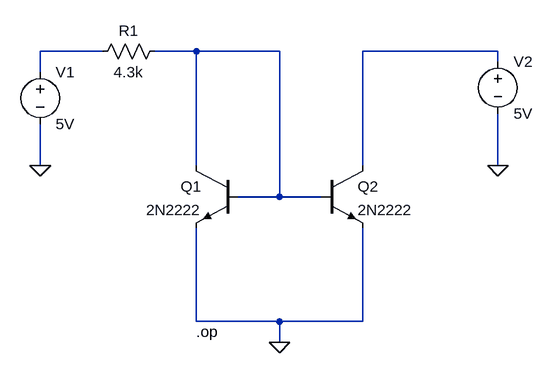
[diagram p0: schematic simple.asc]
simple.asc, the LTspice schematic file:
Version 4
SHEET 1 1128 680
WIRE 272 96 176 96
WIRE 416 96 352 96
WIRE 544 96 416 96
WIRE 880 96 672 96
WIRE 880 112 880 96
WIRE 176 128 176 96
WIRE 176 272 176 208
WIRE 416 272 416 96
WIRE 672 272 672 96
WIRE 880 272 880 192
WIRE 544 320 544 96
WIRE 544 320 480 320
WIRE 608 320 544 320
WIRE 416 512 416 368
WIRE 544 512 416 512
WIRE 672 512 672 368
WIRE 672 512 544 512
WIRE 544 544 544 512
FLAG 176 272 0
FLAG 880 272 0
FLAG 544 544 0
SYMBOL voltage 176 112 R0
WINDOW 123 0 0 Left 0
WINDOW 39 0 0 Left 0
SYMATTR InstName V1
SYMATTR Value 5V
SYMBOL voltage 880 96 R0
SYMATTR InstName V2
SYMATTR Value 5V
SYMBOL npn 480 272 M0
SYMATTR InstName Q1
SYMATTR Value 2N2222
SYMBOL npn 608 272 R0
SYMATTR InstName Q2
SYMATTR Value 2N2222
SYMBOL res 368 80 R90
WINDOW 0 0 56 VBottom 2
WINDOW 3 32 56 VTop 2
SYMATTR InstName R1
SYMATTR Value 4.3k
TEXT 416 528 Left 2 !.op

The netlist it stands for:
* simple.asc
V1 N001 0 5V
V2 N003 0 5V
Q1 N002 N002 0 0 2N2222
Q2 N003 N002 0 0 2N2222
R1 N002 N001 4.3k
.model NPN NPN
.model PNP PNP
.lib standard.bjt
.op
.backanno
.end